# EAGLE design ardBeeQueenWMountHolesWMountedRelays105x84 (EAGLE 9.3.1)
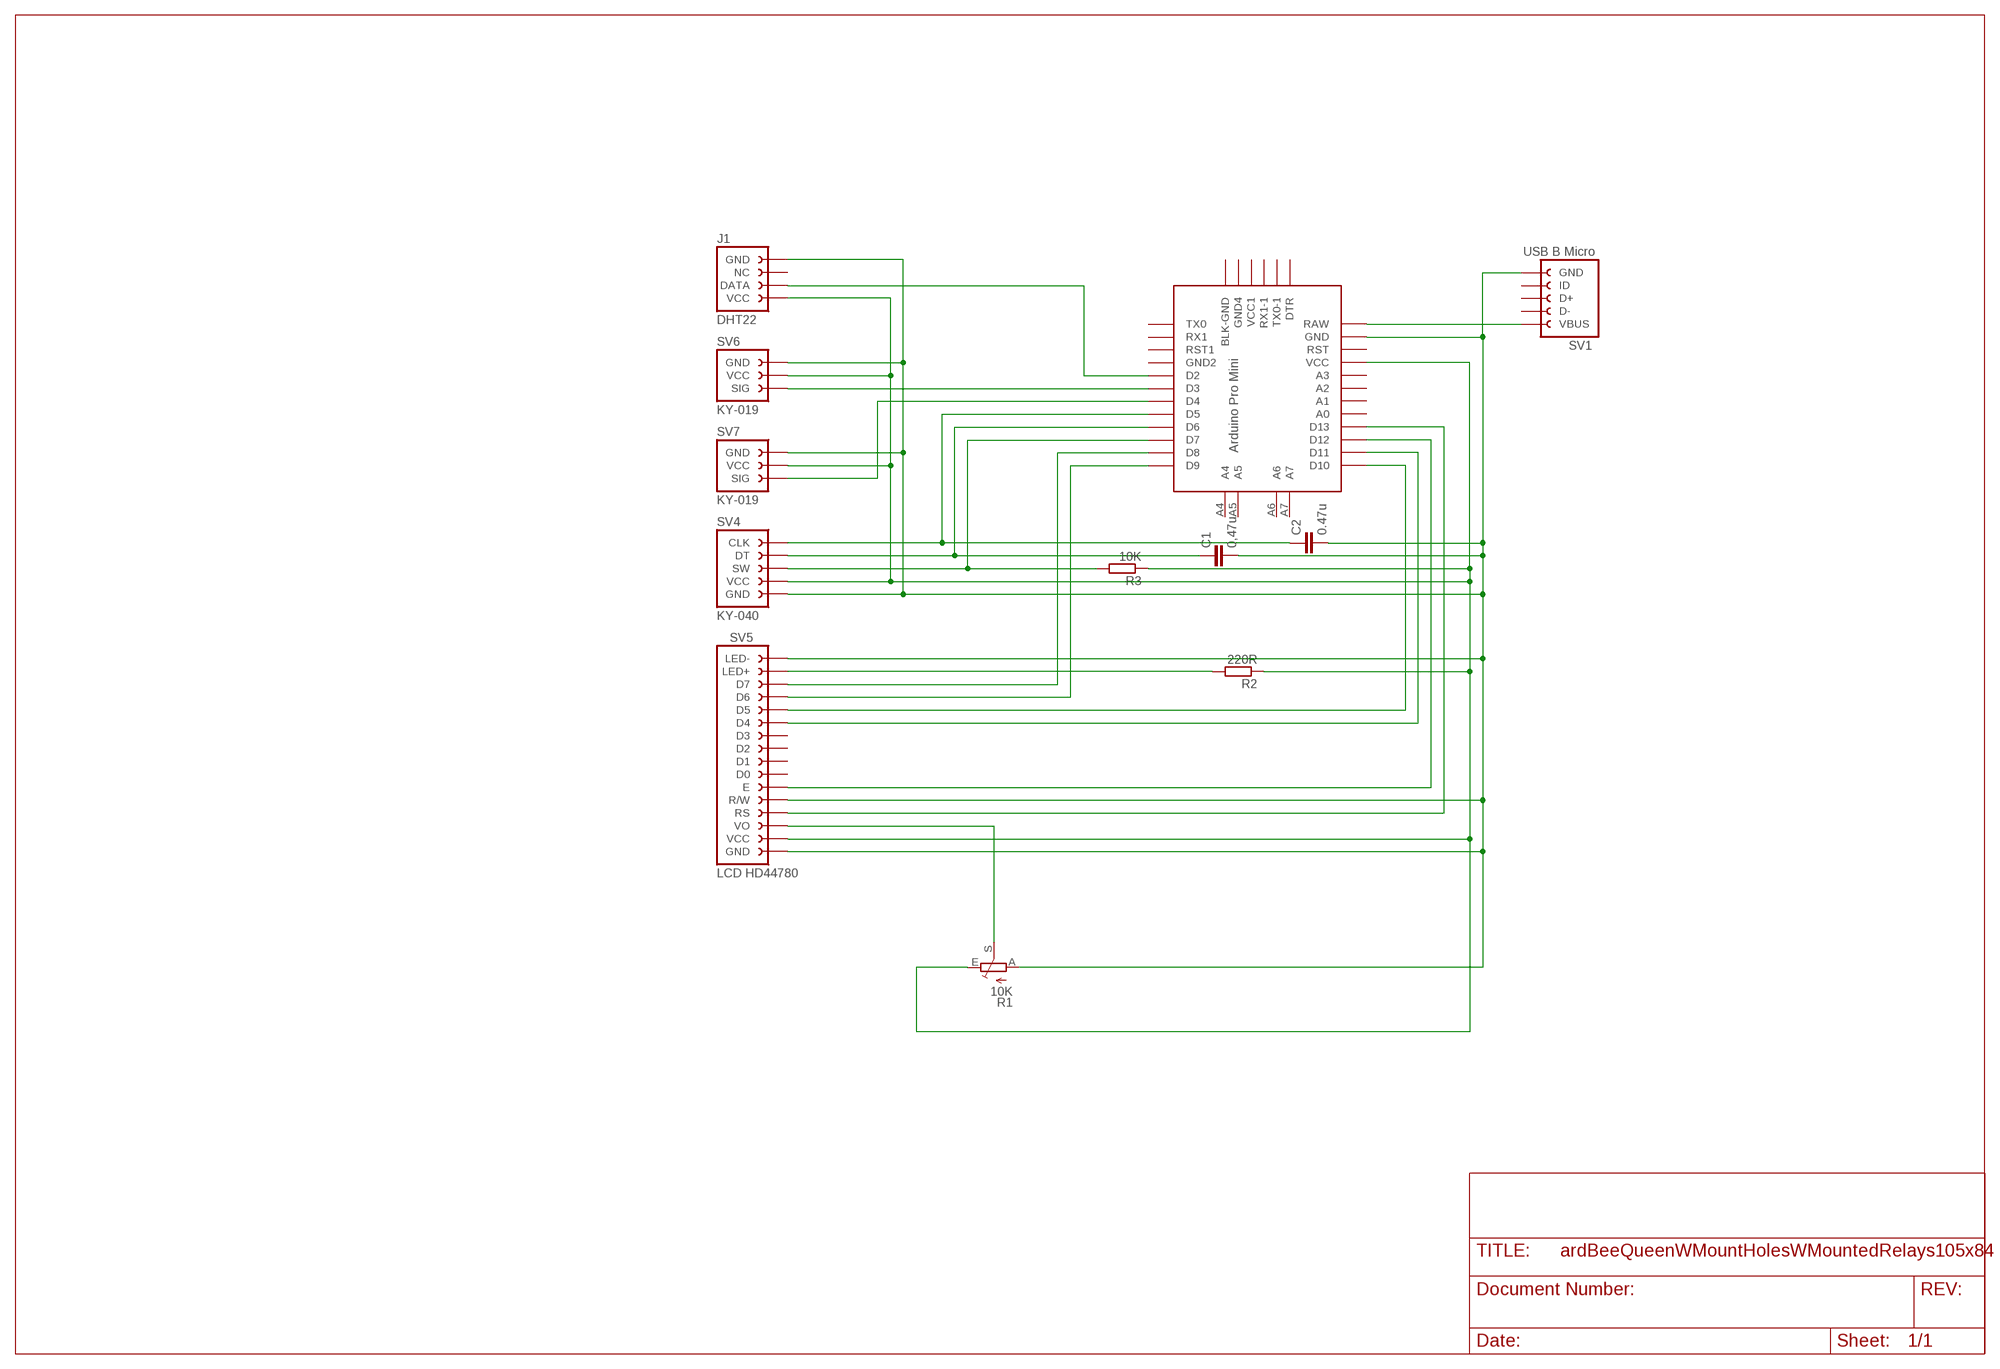
[diagram p0: schematic, sheet 1]

## Parts
C1  0,47u  C-EU050-024X044  [C050-024X044]
C2  0.47u  C-EU050-024X044  [C050-024X044]
J1  DHT22_4-PIN_FEMALE_HEADERPTH  [DHT22_4-PIN_FEMALE_HEADER]
R1  10K  TRIM_EU-B25P  [B25P]
R2  220R  R-EU_0207/10  [0207/10]
R3  10K  R-EU_0207/10  [0207/10]
SV1  MICROUSB_B_BREAKOUT_5-PIN_FEMALE_HEADERWITH_MOUNT_HOLES  [MICROUSB_B_BREAKOUT_5-PIN_FEMALE_HEADER_W_MOUNT_HOLES]
SV4  KY-040_5-PIN_FEMALE_HEADER  [KY-040_5-PIN_FEMALE_HEADER]
SV5  LCD-HD44780-16-PIN_FEMALE_HEADER  [LCD-HD44780-16-PIN_FEMALE_HEADER]
SV6  KY-019_3-PIN_FEMALE_HEADERANGLED_W_MOUNT_HOLES  [KY-019_3-PIN_FEMALE_HEADER_ANGLED_W_MOUNT_HOLES]
SV7  KY-019_3-PIN_FEMALE_HEADERANGLED_W_MOUNT_HOLES  [KY-019_3-PIN_FEMALE_HEADER_ANGLED_W_MOUNT_HOLES]
U$1  ARDUINO_PRO_MINI-2  [ARDUINO_PRO_MINI-2]

## Nets
N$1: R1.S SV5.VO
N$2: R2.2 SV5.LED+
N$3: SV5.D6 U$1.D9
N$4: SV5.D7 U$1.D8
N$5: SV5.D5 U$1.D10
N$6: SV5.D4 U$1.D11
N$7: SV5.E U$1.D12
N$8: SV5.RS U$1.D13
N$9: R3.2 SV4.SW U$1.D7
N$10: C1.1 SV4.DT U$1.D6
N$11: C2.1 SV4.CLK U$1.D5
N$12: J1.DATA U$1.D2
N$13: SV6.SIG U$1.D3
N$14: SV7.SIG U$1.D4
N$15: J1.VCC R1.E R2.1 R3.1 SV4.VCC SV5.VCC SV6.VCC SV7.VCC U$1.VCC
N$16: C1.2 C2.2 J1.GND R1.A SV1.GND SV4.GND SV5.GND SV5.LED- SV5.R/W SV6.GND SV7.GND U$1.GND
N$17: SV1.VBUS U$1.RAW
Unconnected: J1.NC SV1.D+ SV1.D- SV1.ID SV5.D0 SV5.D1 SV5.D2 SV5.D3 U$1.A0 U$1.A1 U$1.A2 U$1.A3 U$1.A4 U$1.A5 U$1.A6 U$1.A7 U$1.BLK-GND U$1.DTR U$1.GND1(GND2) U$1.GND3(GND4) U$1.RST U$1.RST1 U$1.RX1 U$1.RX1-1 U$1.TX0 U$1.TX0-1 U$1.VCC1

## Library data of the parts
C1 C2 = rcl:C-EU: CAPACITOR, European symbol; SPICEPREFIX: C
J1 = myLib-01-Headers:DHT22_4-PIN_FEMALE_HEADER: Header for the DHT22 four pin module. Female; PROD_ID: CONN-09696
R1 = pot:TRIM_EU-: POTENTIOMETER
R2 R3 = rcl:R-EU_: RESISTOR, European symbol; SPICEPREFIX: R
SV1 = myLib-01-Headers:MICROUSB_B_BREAKOUT_5-PIN_FEMALE_HEADER: Header for the micro USB five pin breakout Female
SV4 = myLib-01-Headers:KY-040_5-PIN_FEMALE_HEADER: Header for the 5 pin KY-040 arduino rotary encoder module Female https://www.keyestudio.com/free-shipping-keyestudio-rotary-rotation-encoder-module-for-arduino-p0127.html https://tkkrlab.nl/wiki/Arduino_KY-040_Rotary_encoder_module; OC_FARNELL: unknown; OC_NEWARK: unknown
SV5 = myLib-01-Headers:LCD-HD44780-16-PIN_FEMALE_HEADER: Header for the 16 pin HD44780 LCD module Female; OC_FARNELL: unknown; OC_NEWARK: unknown
SV6 SV7 = myLib-01-Headers:KY-019_3-PIN_FEMALE_HEADER: Header for the 3 pin KY-019 arduino relay module Female https://www.keyestudio.com/free-shipping-keyestudio-single-5v-relay-module-compatible-with-arduino-uno-r3-mega-p0195-p0195.html https://tkkrlab.nl/wiki/Arduino_KY-019_5V_relay_module Board size: 27 x 34 mm Hole distances: 20.05 x 29 mm Lower edge to lower holes and in pins: 3 mm Hole diameter: 3.5 mm Lower left hole to Sig pin: 11 mm - pin to lower right hole: 4.5 mm Pins reaches 5 mm outside board edge
U$1 = myLib-02-Arduino:ARDUINO_PRO_MINI-2: Arduino Pro Mini Layout 2 Sparkfun.com

## Net classes
0 default: width 0.406 mm, clearance 0.152 mm

## Board
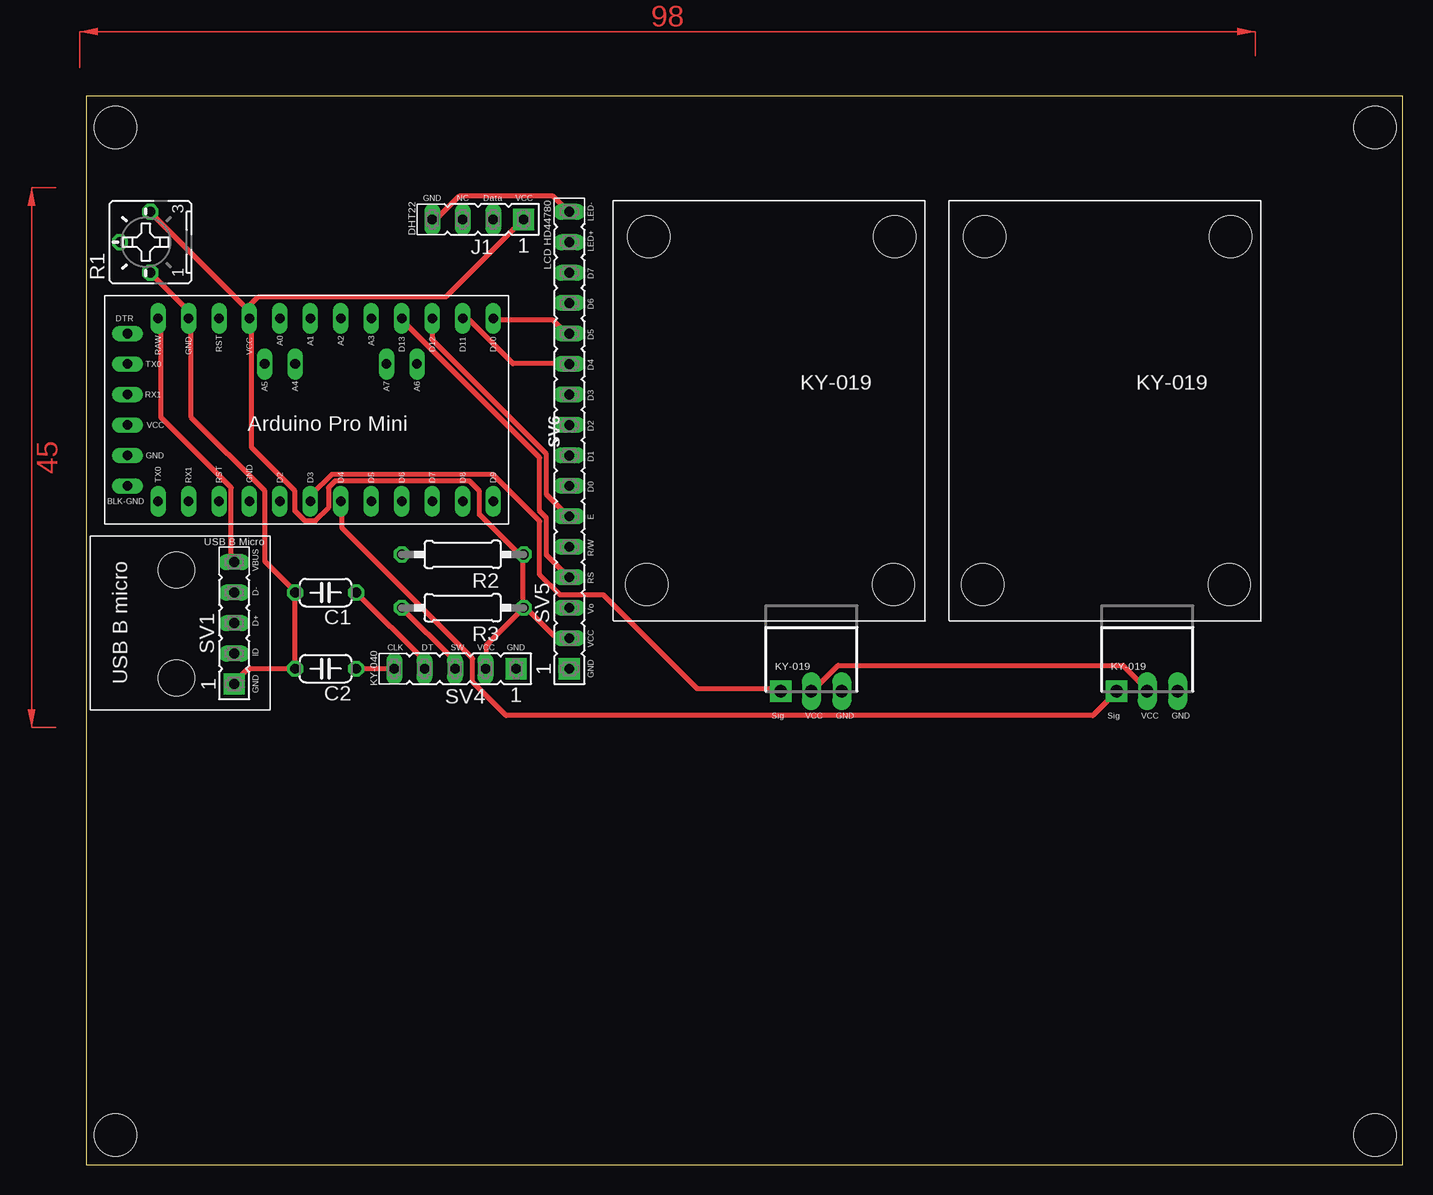
[diagram p1: board, top side]
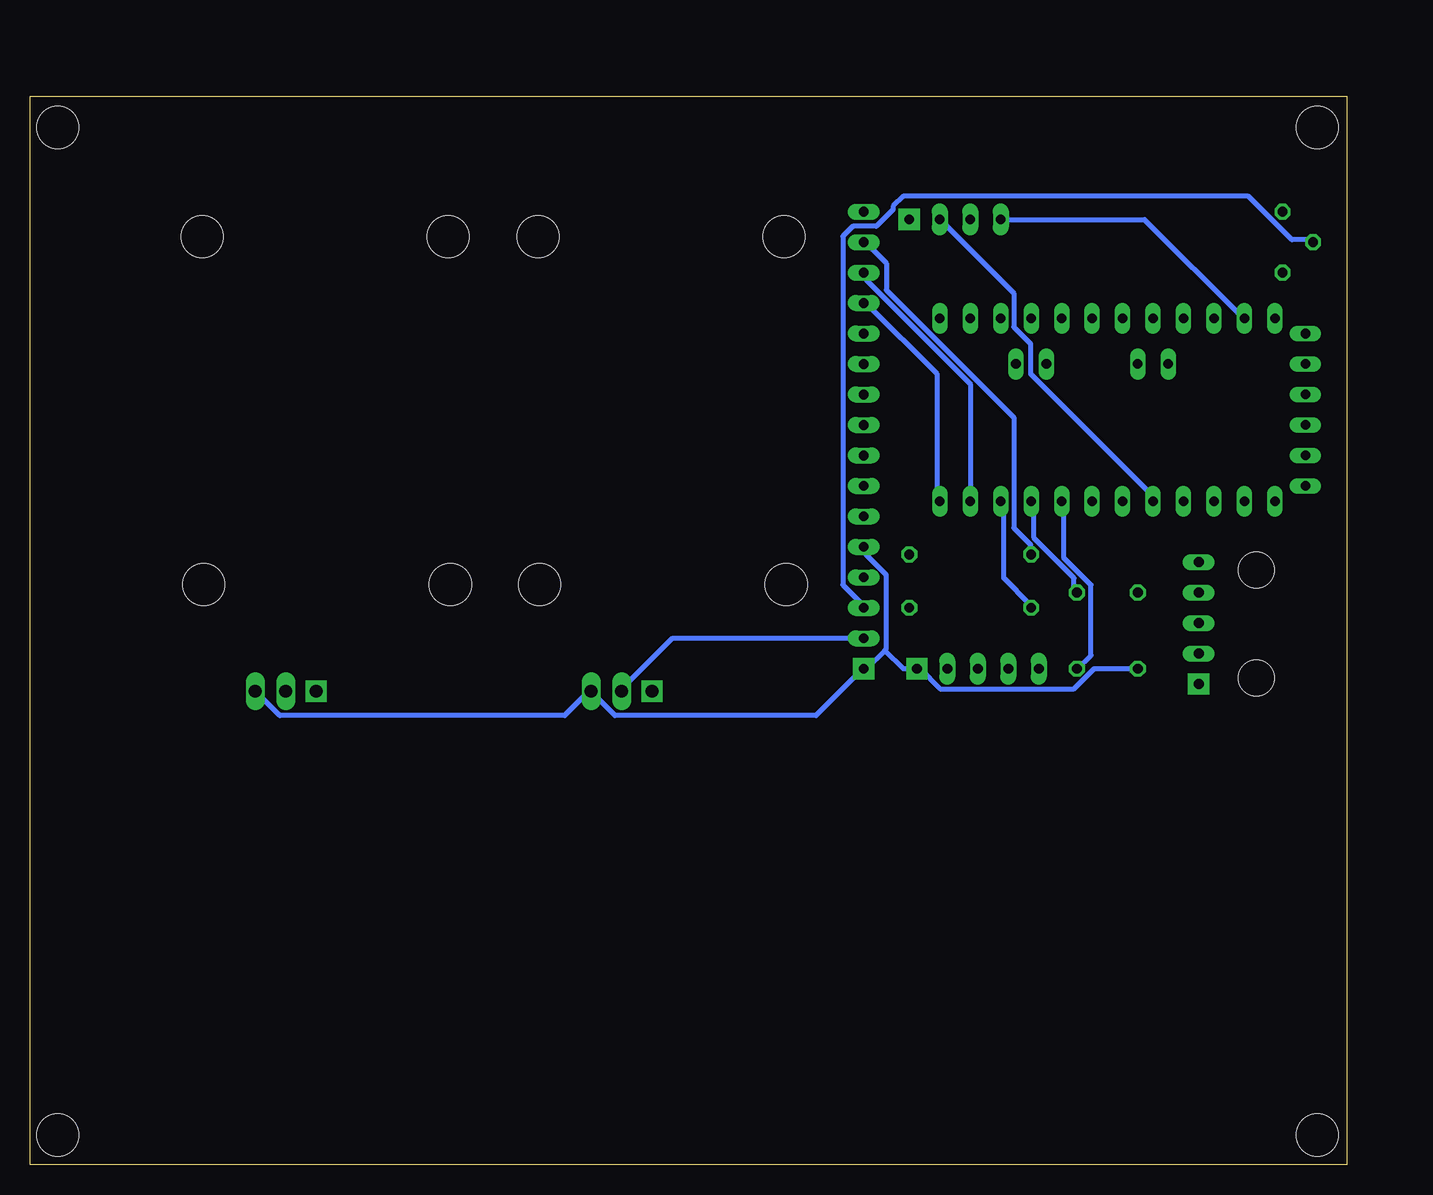
[diagram p2: board, bottom side, seen from below]

Size 109.75 x 89.09 mm. Coordinates in mm from the lower left corner, seen from the top.
Outline: 0,0 109.75,0 109.75,89.09 0,89.09 0,0
Copper layers (1*16): Top 0.035mm / dielectric 1.5mm / Bottom 0.035mm
Design rules "default": minimum track width 6mil, minimum drill 0.35mm, track to track 6mil, track to pad 6mil, pad to pad 6mil, via to via 6mil, smd to smd 6mil, copper to edge 40mil, drill to drill 6mil, minimum pad ring 10mil, minimum via ring 8mil, stop-mask expansion 4mil, vias tented up to drill 0mil, thermal gap 10mil
Holes 3.5 mm at 2.43,86.47 107.43,86.47 2.43,2.47 107.43,2.47

### Footprints (pad centres in the part's own frame; a part is rotated, then mirrored left to right if it is on the bottom)
C050-024X044 = drill 0.813 octagon: 1 -2.54,0; 2 2.54,0
DHT22_4-PIN_FEMALE_HEADER = drill 0.813 long: DATA 2.54,0; GND 7.62,0; NC 5.08,0 | drill 0.813 pad 1.778 square: VCC 0,0
B25P = drill 0.813 octagon: A -2.54,0; E 2.54,0; S 0,2.54
0207/10 = drill 0.813 octagon: 1 -5.08,0; 2 5.08,0
MICROUSB_B_BREAKOUT_5-PIN_FEMALE_HEADER_W_MOUNT_HOLES = drill 0.813 long: D+ 5.08,0; D- 7.62,0; ID 2.54,0; VBUS 10.16,0 | drill 0.813 pad 1.778 square: GND 0,0 | hole 3: 0.508,4.81; 9.508,4.81
KY-040_5-PIN_FEMALE_HEADER = drill 0.813 long: CLK 10.16,0; DT 7.62,0; SW 5.08,0; VCC 2.54,0 | drill 0.813 pad 1.778 square: GND 0,0
LCD-HD44780-16-PIN_FEMALE_HEADER = drill 0.813 long: D0 15.24,0; D1 17.78,0; D2 20.32,0; D3 22.86,0; D4 25.4,0; D5 27.94,0; D6 30.48,0; D7 33.02,0; E 12.7,0; LED+ 35.56,0; LED- 38.1,0; R/W 10.16,0; RS 7.62,0; VCC 2.54,0; VO 5.08,0 | drill 0.813 pad 1.778 square: GND 0,0
KY-019_3-PIN_FEMALE_HEADER_ANGLED_W_MOUNT_HOLES = drill 1.067 long: GND 5.08,0; VCC 2.54,0 | drill 1.067 pad 1.778 square: SIG 0,0 | hole 3.5: -11.176,8.89; 9.39,8.89; -11,37.89; 9.5,37.89
ARDUINO_PRO_MINI-2 = drill 0.8 long: A0 6.35,2.54; A1 6.35,0; A2 6.35,-2.54; A3 6.35,-5.08; A4 2.54,1.27; A5 2.54,3.81; A6 2.54,-8.89; A7 2.54,-6.35; BLK-GND -7.62,15.24; D2 -8.89,2.54; D3 -8.89,0; D4 -8.89,-2.54; D5 -8.89,-5.08; D6 -8.89,-7.62; D7 -8.89,-10.16; D8 -8.89,-12.7; D9 -8.89,-15.24; D10 6.35,-15.24; D11 6.35,-12.7; D12 6.35,-10.16; D13 6.35,-7.62; DTR 5.08,15.24; GND 6.35,10.16; GND1 -8.89,5.08; GND3 -5.08,15.24; RAW 6.35,12.7; RST 6.35,7.62; RST1 -8.89,7.62; RX1 -8.89,10.16; RX1-1 0,15.24; TX0 -8.89,12.7; TX0-1 2.54,15.24; VCC 6.35,5.08; VCC1 -2.54,15.24

### Placement (x,y rotation side)
C1  19.94,47.7 180 top
C2  19.94,41.35 180 top
J1  36.45,78.81 180 top
R1  5.33,76.91 90 top
R2  31.37,50.88 180 top
R3  31.37,46.43 180 top
SV1  12.32,40.08 90 top
SV4  35.81,41.35 180 top
SV5  40.26,41.35 90 top
SV6  57.89,39.47 0 top
SV7  85.89,39.47 0 top
U$1  18.67,64.21 90 top

### Tracks (layer width: path | path; a pad name or v marks a point on that pad's centre or on a via)
N$1
  Bottom 0.406: SV5.VO 40.31,46.66 41.99,48.34 41.99,77.39 41.15,78.23 39.19,78.23 37.8,79.63 37.8,79.91 36.96,80.75 8.18,80.75 4.55,77.11 2.87,77.11 R1.S
N$2
  Bottom 0.406: R2.2 26.34,51.13 26.34,51.69 27.74,53.08 27.74,62.3 38.35,72.92 38.35,75.16 40.03,76.83 SV5.LED+
N$3
  Bottom 0.406: U$1.D9 34.16,55.32 34.16,65.94 40.03,71.8 SV5.D6
N$4
  Bottom 0.406: U$1.D8 31.37,65.1 40.03,73.76 40.03,74.32 SV5.D7
N$5
  Top 0.406: U$1.D10 34.16,70.41 38.91,70.41 40.03,69.29 SV5.D5
N$6
  Top 0.406: U$1.D11 31.37,70.41 31.93,70.41 35.56,66.78 40.03,66.78 SV5.D4
N$7
  Top 0.406: U$1.D12 28.86,70.41 28.86,68.73 38.35,59.23 38.35,55.88 40.03,54.2 SV5.E
N$8
  Top 0.406: U$1.D13 26.34,70.41 37.8,58.95 37.8,54.48 38.35,53.92 38.35,50.85 40.03,49.17 SV5.RS
N$9
  Top 0.406: R3.2 30.53,42.19 30.53,41.35 SV4.SW
  Bottom 0.406: U$1.D7 28.58,55.32 28.58,48.89 26.34,46.66 R3.2
N$10
  Top 0.406: SV4.DT 28.02,41.35 28.02,42.19 22.71,47.5 C1.1
  Bottom 0.406: U$1.D6 26.06,55.32 26.06,52.25 22.71,48.89 22.71,47.78 C1.1
N$11
  Top 0.406: C2.1 SV4.CLK
  Bottom 0.406: U$1.D5 23.55,55.32 23.55,50.57 21.31,48.34 21.31,42.47 22.43,41.35 C2.1
N$12
  Bottom 0.406: J1.DATA 27.74,72.64 27.74,69.85 26.34,68.45 26.34,65.94 16.28,55.88 16.28,55.32 U$1.D2
N$13
  Top 0.406: U$1.D3 18.8,55.32 18.8,55.88 20.47,57.55 33.88,57.55 37.8,53.64 37.8,49.17 39.47,47.5 43.1,47.5 50.93,39.67 57.63,39.67 SV6.SIG
N$14
  Top 0.406: U$1.D4 21.31,55.32 21.31,53.08 32.21,42.19 32.21,40.23 35,37.44 83.9,37.44 85.85,39.39 SV7.SIG
N$15
  Top 0.406: U$1.VCC 13.49,70.69 13.49,71.25 5.39,79.35 R1.E | J1.VCC 36.4,78.79 29.97,72.36 14.33,72.36 13.49,71.53 U$1.VCC | R3.1 33.33,43.31 33.33,41.35 SV4.VCC | SV5.VCC 40.03,44.14 38.91,44.14 36.68,46.38 R3.1 | 36.4,50.57 36.4,46.66 R3.1 | 36.4,50.57 36.4,50.85 R2.1 36.4,50.57 | SV7.VCC 88.37,39.67 86.41,41.63 62.66,41.63 60.71,39.67 SV6.VCC | 36.4,50.57 32.77,54.2 32.77,56.16 31.93,57 20.75,57 20.19,56.44 20.19,54.76 19.08,53.64 18.24,53.64 17.4,54.48 17.4,56.16 13.77,59.79 13.77,70.41 U$1.VCC
  Bottom 0.406: SV6.VCC 60.43,39.67 56.24,43.87 40.31,43.87 SV5.VCC
N$16
  Top 0.406: R1.A 8.46,71.25 8.46,70.69 U$1.GND 8.74,70.41 8.74,62.3 14.88,56.16 14.88,50.29 17.4,47.78 C1.2 C2.2 13.49,41.35 12.37,40.23 SV1.GND | J1.GND 28.86,79.07 29.41,79.07 31.09,80.75 38.91,80.75 40.03,79.63 SV5.LED-
  Bottom 0.406: U$1.GND 8.74,70.69 16.84,78.79 28.58,78.79 J1.GND | 38.49,42.89 40.03,41.35 SV5.GND 40.31,41.35 44.22,37.44 60.99,37.44 62.94,39.39 SV6.GND 63.22,39.39 65.18,37.44 88.93,37.44 90.88,39.39 SV7.GND | 38.49,42.89 38.35,43.03 38.35,49.17 40.03,50.85 40.03,51.41 SV5.R/W | 38.49,42.89 36.96,41.35 SV4.GND 35.56,41.35 33.88,39.67 22.71,39.67 21.03,41.35 C2.2
N$17
  Top 0.406: U$1.RAW 6.22,70.41 6.22,62.3 12.09,56.44 12.09,50.29 SV1.VBUS
(copper drawn outside any net)
  shapes: Top area x2